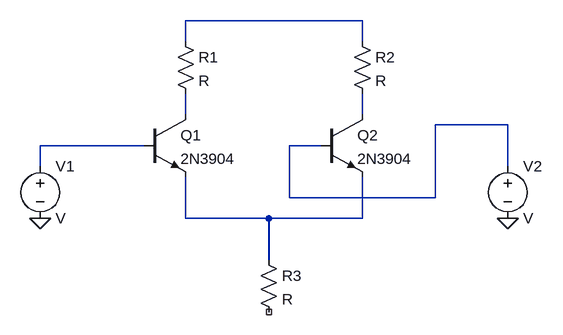
[diagram p0: schematic Draft6.asc]
Draft6.asc, the LTspice schematic file:
Version 4
SHEET 1 880 680
WIRE 544 128 272 128
WIRE 272 160 272 128
WIRE 544 160 544 128
WIRE 272 272 272 240
WIRE 544 272 544 240
WIRE 768 288 656 288
WIRE 208 320 48 320
WIRE 480 320 432 320
WIRE 48 352 48 320
WIRE 768 352 768 288
WIRE 432 400 432 320
WIRE 656 400 656 288
WIRE 656 400 432 400
WIRE 272 432 272 368
WIRE 400 432 272 432
WIRE 544 432 544 368
WIRE 544 432 400 432
WIRE 400 496 400 432
FLAG 768 432 0
FLAG 48 432 0
SYMBOL Res 256 144 R0
SYMATTR InstName R1
SYMBOL Res 528 144 R0
SYMATTR InstName R2
SYMBOL Res 384 480 R0
SYMATTR InstName R3
SYMBOL Voltage 48 336 R0
SYMATTR InstName V1
SYMBOL Voltage 768 336 R0
SYMATTR InstName V2
SYMBOL npn 208 272 R0
SYMATTR InstName Q1
SYMATTR Value 2N3904
SYMBOL npn 480 272 R0
SYMATTR InstName Q2
SYMATTR Value 2N3904

The netlist it stands for:
* Draft6.asc
R1 N001 N002 R
R2 N001 N003 R
R3 N006 NC_01 R
V1 N005 0 V
V2 N004 0 V
Q1 N002 N005 N006 0 2N3904
Q2 N003 N004 N006 0 2N3904
.model NPN NPN
.model PNP PNP
.lib standard.bjt
.backanno
.end